# EAGLE design fonteSCH (EAGLE 9.6.2)
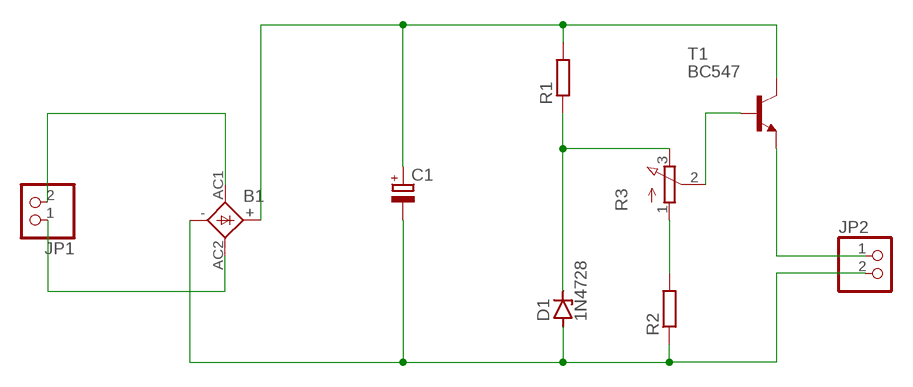
[diagram p0: schematic, sheet 1]

## Parts
B1  1KAB  [1KAB]
C1  CPOL-EUE5-10.5  [E5-10,5]
D1  1N4728  [DO41Z10]
JP1  PINHD-1X2  [1X02]
JP2  PINHD-1X2  [1X02]
R1  R-EU_0207/10  [0207/10]
R2  R-EU_0207/10  [0207/10]
R3  3RP/1610N  [3RP/1610N]
T1  BC547  [TO92]

## Nets
N$1: B1.AC1 JP1.2
N$2: B1.AC2 JP1.1
N$3: B1.- C1.- D1.A JP2.2 R2.1
N$4: B1.+ C1.+ R1.2 T1.3(C)
N$5: D1.C R1.1 R3.3(E)
N$6: R2.2 R3.1(A)
N$7: R3.2(S) T1.2(B)
N$8: JP2.1 T1.1(E)

## Library data of the parts
B1 = rectifier:1KAB: RECTIFIER grid 5,08 x 5,08 mm
C1 = rcl:CPOL-EU: POLARIZED CAPACITOR, European symbol; SPICEPREFIX: C
D1 = diode:1N4728: Z DIODE 3.3 V, 1W, 5 percent
JP1 JP2 = pinhead:PINHD-1X2: PIN HEADER
R1 R2 = rcl:R-EU_: RESISTOR, European symbol; SPICEPREFIX: R
R3 = pot:3RP/1610N: 16mm Potentiometer one level Source: http://www.alphapotentiometers.net/html/16mm_pot_2.html
T1 = transistor:BC547: NPN TRANSISTOR

## Board
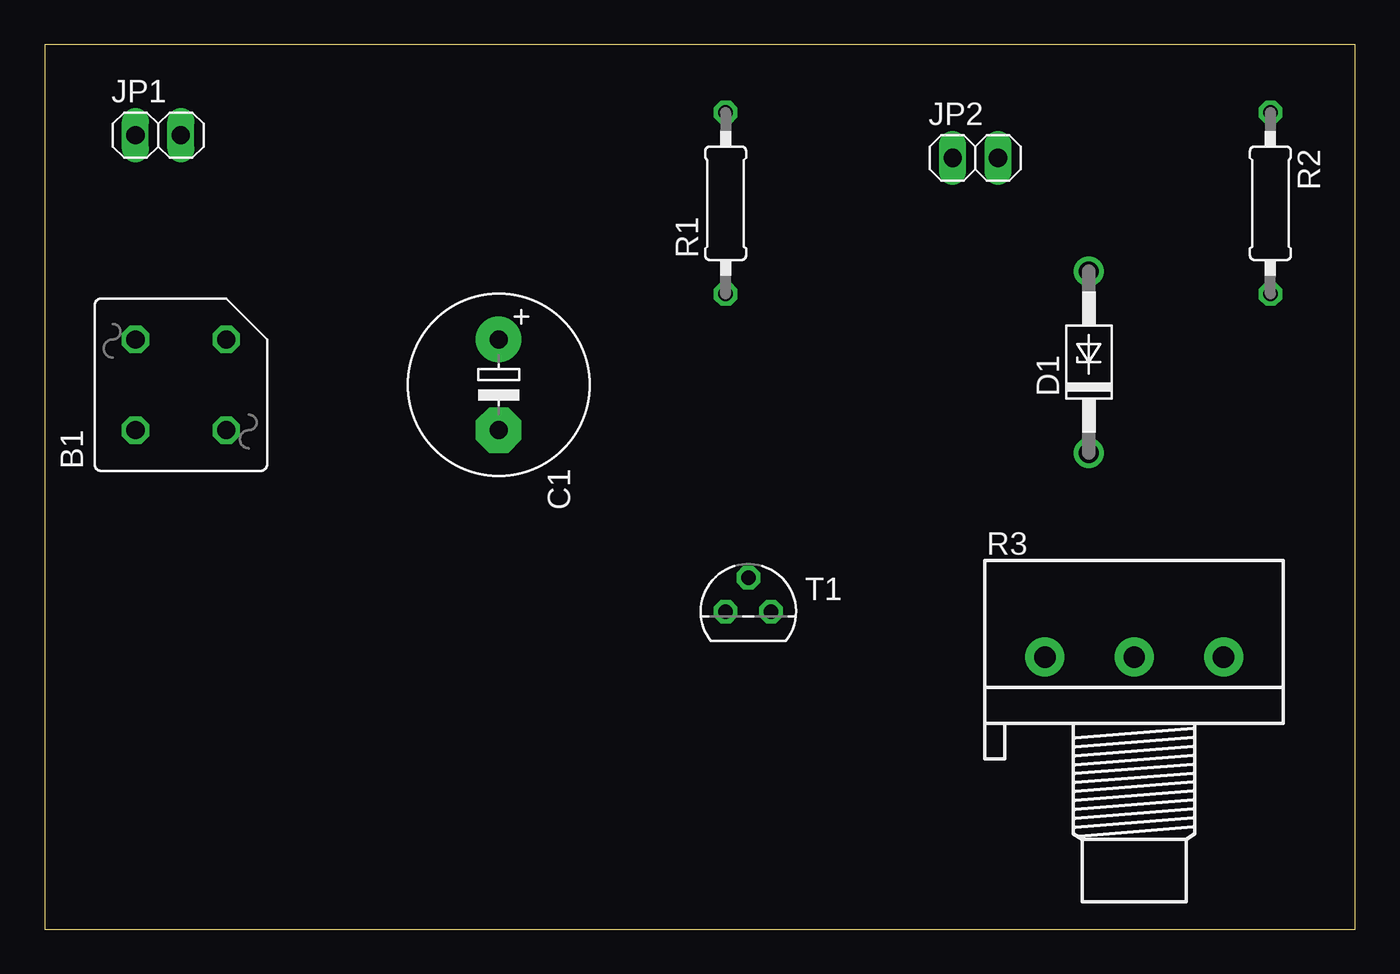
[diagram p1: board, top side]
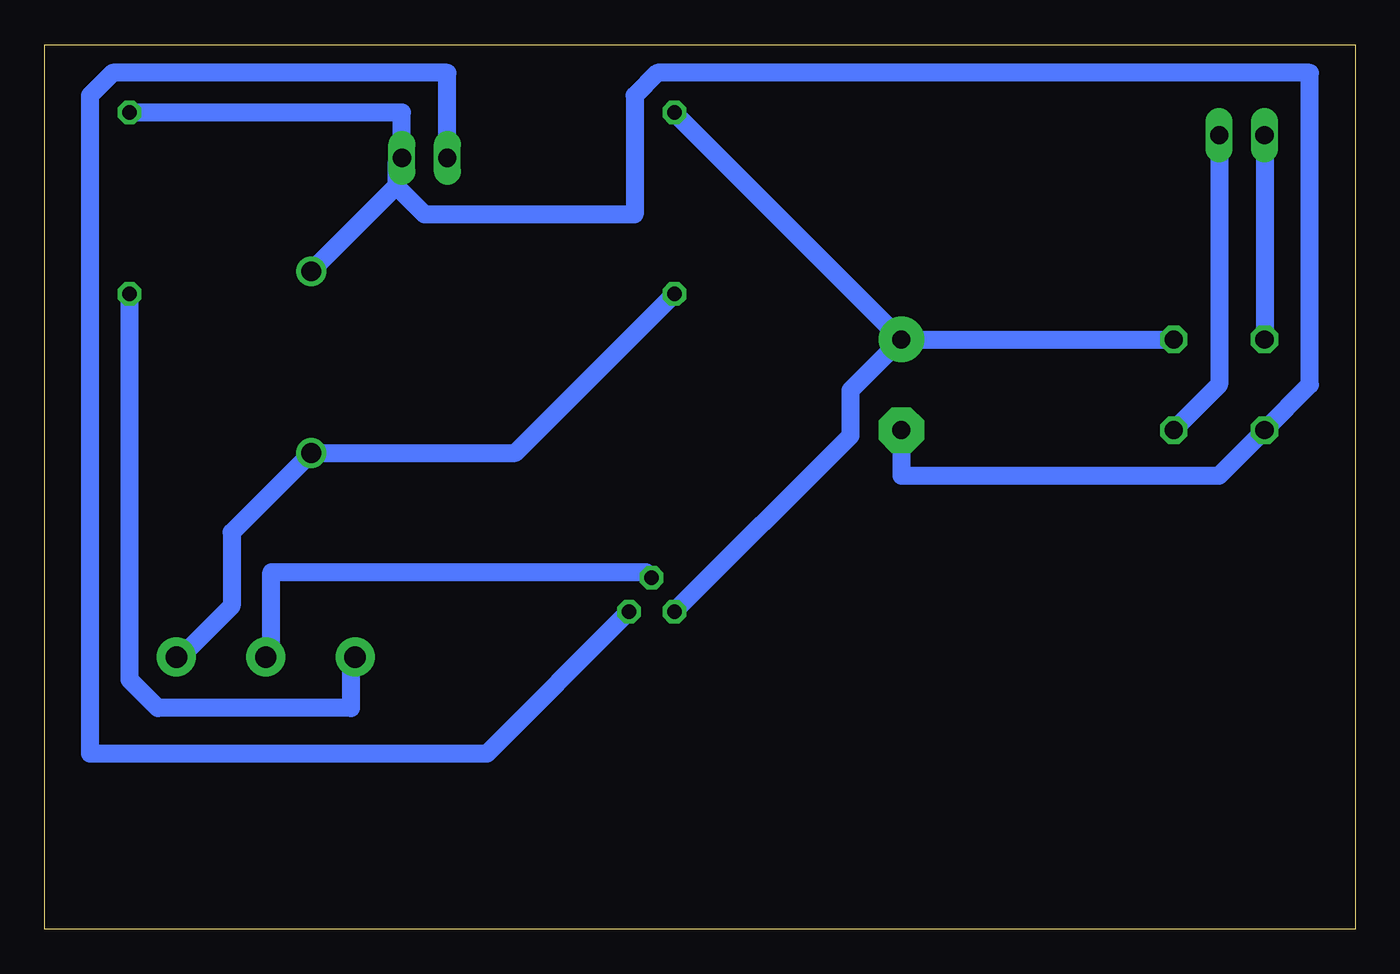
[diagram p2: board, bottom side, seen from below]

Size 73.33 x 49.52 mm. Coordinates in mm from the lower left corner, seen from the top.
Outline: 0,0 73.33,0 73.33,49.52 0,49.52 0,0
Copper layers (1*16): Top 0.035mm / dielectric 1.5mm / Bottom 0.035mm
Design rules "default *": minimum track width 40mil, minimum drill 0.35mm, track to track 40mil, track to pad 40mil, pad to pad 40mil, via to via 40mil, smd to smd 6mil, copper to edge 40mil, drill to drill 6mil, minimum pad ring 10mil, minimum via ring 8mil, stop-mask expansion 4mil, vias tented up to drill 0mil, thermal gap 10mil

### Footprints (pad centres in the part's own frame; a part is rotated, then mirrored left to right if it is on the bottom)
1KAB = drill 1.016 octagon: + 2.54,-2.54; - -2.54,2.54; AC1 -2.54,-2.54; AC2 2.54,2.54
E5-10,5 = drill 1.016 pad 2.54: + -2.54,0 | drill 1.016 pad 2.54 octagon: - 2.54,0
DO41Z10 = drill 1.118: A 5.08,0; C -5.08,0
1X02 = drill 1.016 long: 1 -1.27,0; 2 1.27,0
0207/10 = drill 0.813 octagon: 1 -5.08,0; 2 5.08,0
3RP/1610N = drill 1.2 pad 2.184: 1 -5,0; 2 0,0; 3 5,0
TO92 = drill 0.813 octagon: 1 1.27,0; 2 0,1.905; 3 -1.27,0

### Placement (x,y rotation side)
B1  7.62,30.48 90 top
C1  25.4,30.48 270 top
D1  58.42,31.75 90 top
JP1  6.35,44.45 0 top
JP2  52.07,43.18 0 top
R1  38.1,40.64 90 top
R2  68.58,40.64 270 top
R3  60.96,15.24 0 top
T1  39.37,17.78 0 top

### Tracks (layer width: path | path; a pad name or v marks a point on that pad's centre or on a via)
N$1
  Bottom 1.016: B1.AC1 7.62,30.48 JP1.2
N$2
  Bottom 1.016: JP1.1 B1.AC2
N$3
  Bottom 1.016: R2.1 53.34,45.72 JP2.2 53.66,42.86 53.66,41.59 | 53.66,41.59 D1.A | C1.- 25.4,25.4 7.62,25.4 B1.- 2.54,30.48 2.54,47.94 39.05,47.94 40.32,46.67 40.32,40 52.07,40 53.66,41.59
N$4
  Bottom 1.016: T1.3 28.26,27.62 28.26,30.16 C1.+ | C1.+ R1.2 | C1.+ B1.+
N$5
  Bottom 1.016: R1.1 46.99,26.67 D1.C 62.87,22.22 62.87,18.1 65.72,15.24 R3.3
N$6
  Bottom 1.016: R2.2 68.58,13.97 66.99,12.38 56.2,12.38 56.2,15.24 R3.1
N$7
  Bottom 1.016: T1.2 39.69,20 60.64,20 60.64,15.56 R3.2
N$8
  Bottom 1.016: T1.1 48.58,9.84 70.8,9.84 70.8,46.67 69.53,47.94 50.8,47.94 JP2.1